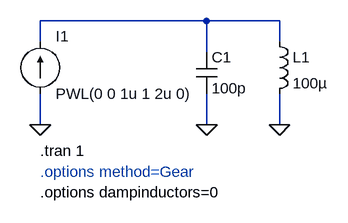
[diagram p0: schematic Gear.asc]
Gear.asc, the LTspice schematic file:
Version 4
SHEET 1 880 680
WIRE 256 176 0 176
WIRE 368 176 256 176
WIRE 0 208 0 176
WIRE 368 208 368 176
WIRE 256 224 256 176
WIRE 0 336 0 288
WIRE 256 336 256 288
WIRE 368 336 368 288
FLAG 256 336 0
FLAG 368 336 0
FLAG 0 336 0
SYMBOL current 0 288 M180
WINDOW 0 24 88 Left 0
WINDOW 3 24 0 Left 0
SYMATTR InstName I1
SYMATTR Value PWL(0 0 1u 1 2u 0)
SYMBOL cap 240 224 R0
SYMATTR InstName C1
SYMATTR Value 100p
SYMBOL ind 352 192 R0
SYMATTR InstName L1
SYMATTR Value 100µ
SYMATTR SpiceLine Rser=0
TEXT 0 376 Left 0 !.tran 1
TEXT 0 440 Left 0 !.options dampinductors=0
TEXT 0 408 Left 0 ;.options method=Gear

The netlist it stands for:
* Gear.asc
I1 0 N001 PWL(0 0 1u 1 2u 0)
C1 N001 0 100p
L1 N001 0 100µ Rser=0
.tran 1
.options dampinductors=0
* .options method=Gear
.backanno
.end